# EAGLE design nasmini (EAGLE 6.5.0)
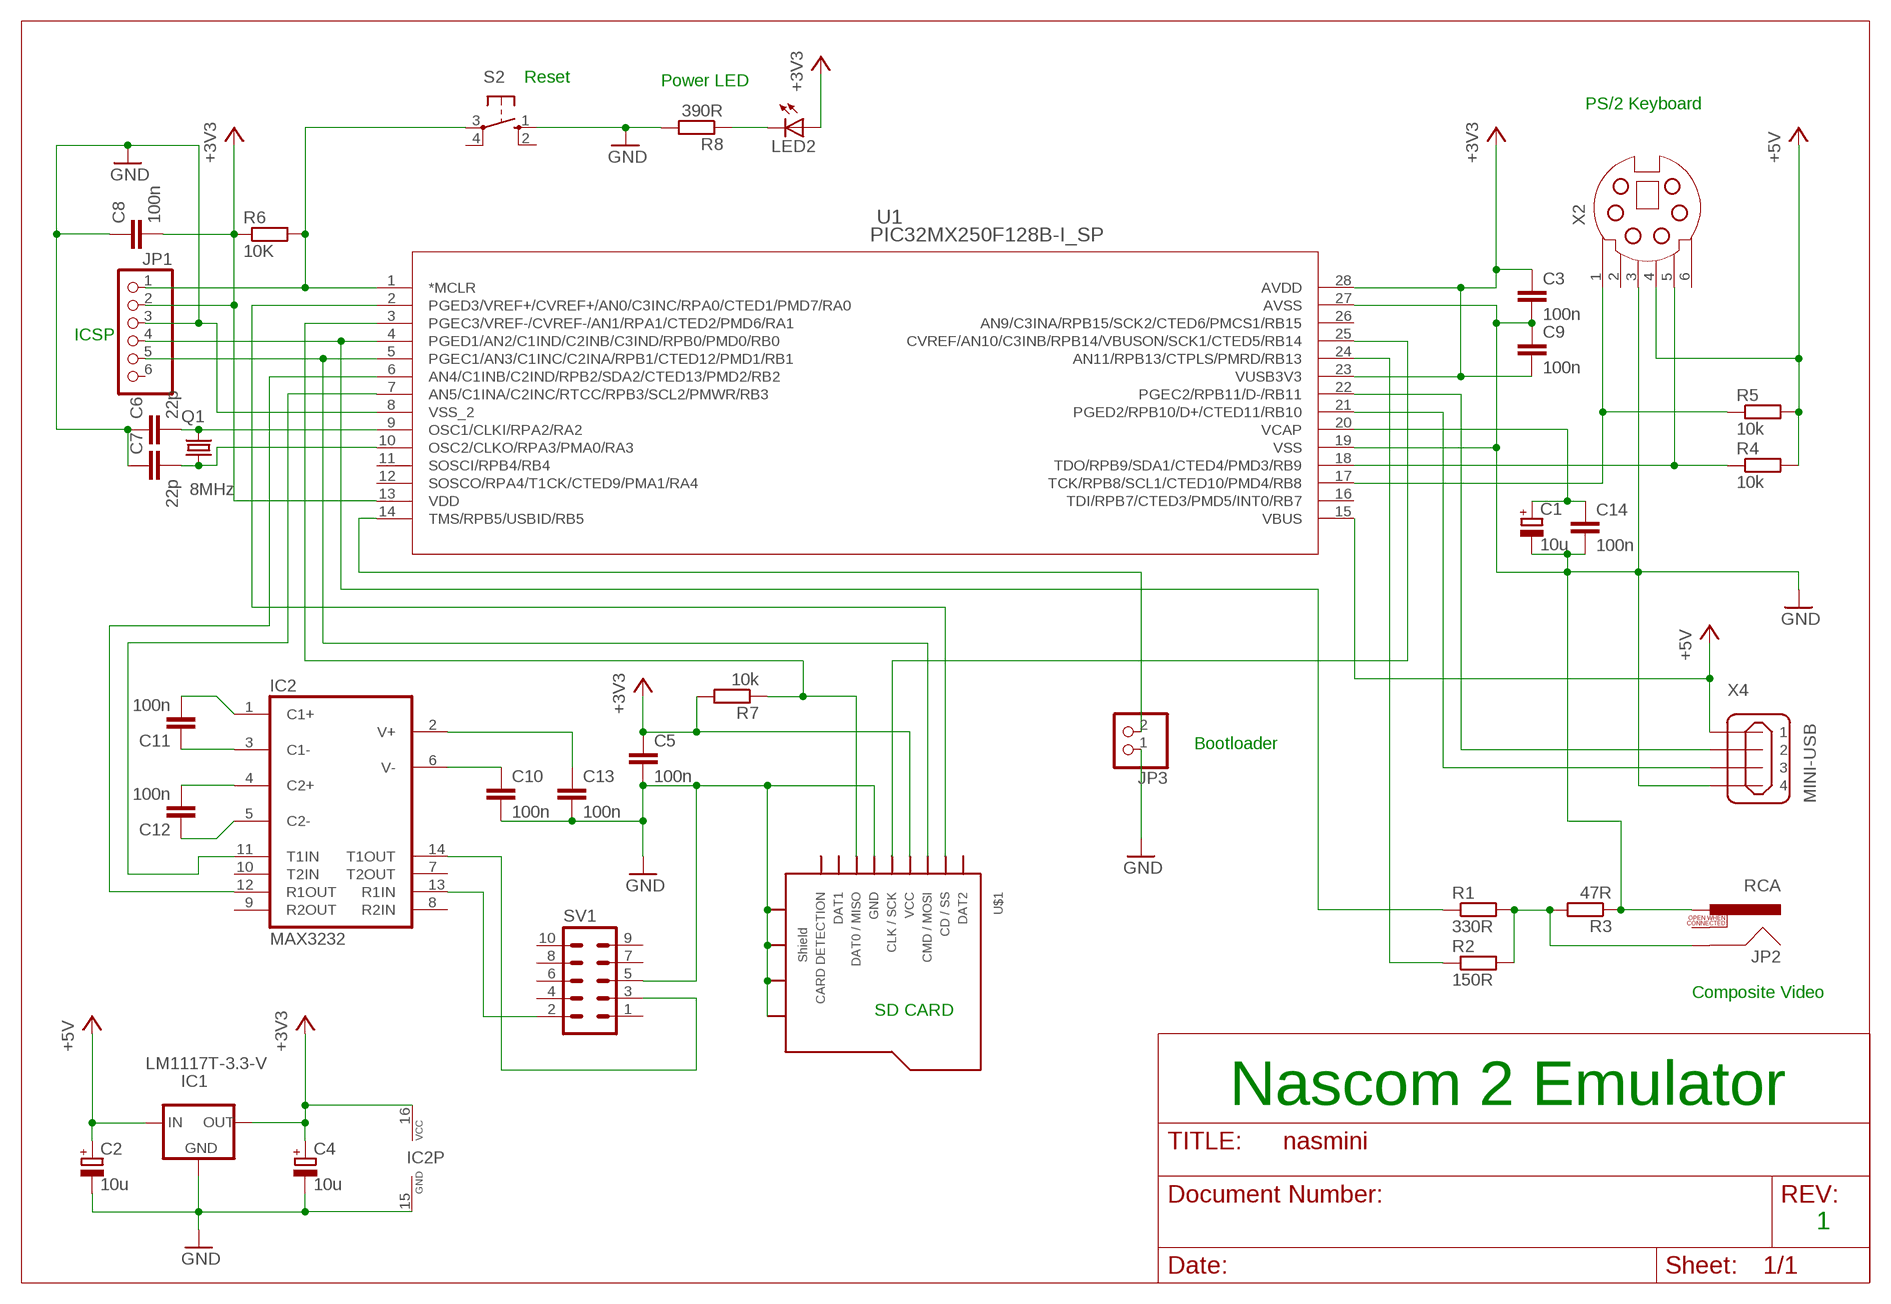
[diagram p0: schematic, sheet 1]

## Parts
C1  10u  CPOL-EUE2.5-5  [E2,5-5]
C2  10u  CPOL-EUE2.5-5  [E2,5-5]
C3  100n  C-EU025-025X050  [C025-025X050]
C4  10u  CPOL-EUE2.5-5  [E2,5-5]
C5  100n  C-EU025-025X050  [C025-025X050]
C6  22p  C-EU025-025X050  [C025-025X050]
C7  22p  C-EU025-025X050  [C025-025X050]
C8  100n  C-EU025-025X050  [C025-025X050]
C9  100n  C-EU025-025X050  [C025-025X050]
C10  100n  C-EU025-025X050  [C025-025X050]
C11  100n  C-EU025-025X050  [C025-025X050]
C12  100n  C-EU025-025X050  [C025-025X050]
C13  100n  C-EU025-025X050  [C025-025X050]
C14  100n  C-EU025-025X050  [C025-025X050]
IC1  LM1117T-3.3-V  [TO220V]
IC2  MAX3232  MAX232  [DIL16]
JP1  PINHD-1X6  [1X06]
JP2  RCA  [RCA]
JP3  PINHD-1X2  [1X02]
LED2  LED3MM  [LED3MM]
Q1  8MHz  CRYSTALHC49S  [HC49/S]
R1  330R  R-EU_0207/7  [0207/7]
R2  150R  R-EU_0207/7  [0207/7]
R3  47R  R-EU_0207/7  [0207/7]
R4  10k  R-EU_0207/7  [0207/7]
R5  10k  R-EU_0207/7  [0207/7]
R6  10K  R-EU_0207/7  [0207/7]
R7  10k  R-EU_0207/7  [0207/7]
R8  390R  R-EU_0207/7  [0207/7]
S2  10-XX  [B3F-10XX]
SV1  MA05-2  [MA05-2]
U1  PIC32MX250F128B-I_SP  [SPDIP28_300MC]
U$1  MICROSD_CARD_POLLIN  [MR**-AP*03**]
X2  MDSSV-F06  [SSV-BC06]
X4  MINI-USB  MINI-USB_SHIELD4P-85-32006-201-1  [85-32006-201-1]

## Nets
+3V3: C3.1 C4.+ C5.1 C8.2 C9.2 IC1.2(OUT) IC2.16(VCC) JP1.2 LED2.A R6.1 R7.2 U1.13(VDD) U1.23(VUSB3V3) U1.28(AVDD) U$1.VCC
+5V: C2.+ IC1.3(IN) R4.2 R5.2 U1.15(VBUS) X2.4 X4.1
GND: C1.- C2.- C3.2 C4.- C5.2 C6.1 C7.1 C8.1 C9.1 C10.2 C13.2 C14.2 IC1.1(GND) IC2.15(GND) JP1.3 JP2.PIN JP3.1 R3.1 R8.2 S2.1(S) SV1.5 U1.8(VSS_2) U1.19(VSS) U1.27(AVSS) U$1.GND U$1.SHD_1(SHD1) U$1.SHD_2(SHD2) U$1.SHD_3(SHD3) U$1.SHD_4(SHD4) X2.3 X4.4
N$1: R5.1 U1.17(TCK/RPB8/SCL1/CTED10/PMD4/RB8) X2.1
N$2: R4.1 U1.18(TDO/RPB9/SDA1/CTED4/PMD3/RB9) X2.5
N$3: R2.1 U1.24(AN11/RPB13/CTPLS/PMRD/RB13)
N$4: JP3.2 U1.14(TMS/RPB5/USBID/RB5)
N$5: JP2.SHELL R1.2 R2.2 R3.2
N$6: IC2.13(R1IN) SV1.2
N$7: C1.+ C14.1 U1.20(VCAP)
N$8: JP1.4 R1.1 U1.4(PGED1/AN2/C1IND/C2INB/C3IND/RPB0/PMD0/RB0)
N$9: JP1.1 R6.2 S2.3(P) U1.1(*MCLR)
N$10: U1.25(CVREF/AN10/C3INB/RPB14/VBUSON/SCK1/CTED5/RB14) U$1.CLK(CLK/SCK)
N$11: U1.2(PGED3/VREF+/CVREF+/AN0/C3INC/RPA0/CTED1/PMD7/RA0) U$1.DAT3/CS(CD/SS)
N$12: R7.1 U1.3(PGEC3/VREF-/CVREF-/AN1/RPA1/CTED2/PMD6/RA1) U$1.DAT0(DAT0/MISO)
N$13: JP1.5 U1.5(PGEC1/AN3/C1INC/C2INA/RPB1/CTED12/PMD1/RB1) U$1.CMD(CMD/MOSI)
N$14: U1.21(PGED2/RPB10/D+/CTED11/RB10) X4.3
N$15: C7.2 Q1.1 U1.10(OSC2/CLKO/RPA3/PMA0/RA3)
N$16: C6.2 Q1.2 U1.9(OSC1/CLKI/RPA2/RA2)
N$17: U1.22(PGEC2/RPB11/D-/RB11) X4.2
N$20: C13.1 IC2.2(V+)
N$21: C10.1 IC2.6(V-)
N$22: C12.1 IC2.5(C2-)
N$23: C12.2 IC2.4(C2+)
N$24: C11.1 IC2.3(C1-)
N$25: C11.2 IC2.1(C1+)
N$26: IC2.11(T1IN) U1.7(AN5/C1INA/C2INC/RTCC/RPB3/SCL2/PMWR/RB3)
N$27: IC2.12(R1OUT) U1.6(AN4/C1INB/C2IND/RPB2/SDA2/CTED13/PMD2/RB2)
N$28: LED2.K(C) R8.1
N$29: IC2.14(T1OUT) SV1.3
Unconnected: IC2.7(T2OUT) IC2.8(R2IN) IC2.9(R2OUT) IC2.10(T2IN) JP1.6 JP2.SWITCH S2.2(S1) S2.4(P1) SV1.1 SV1.4 SV1.6 SV1.7 SV1.8 SV1.9 SV1.10 U1.11(SOSCI/RPB4/RB4) U1.12(SOSCO/RPA4/T1CK/CTED9/PMA1/RA4) U1.16(TDI/RPB7/CTED3/PMD5/INT0/RB7) U1.26(AN9/C3INA/RPB15/SCK2/CTED6/PMCS1/RB15) U$1.CARD_DETECTION(CARD_D) U$1.DAT1 U$1.DAT2 X2.2 X2.6 X4.M1(S1) X4.M2(S2)

## Notes on the sheet
- Reset | Power LED
- PS/2 Keyboard
- ICSP
- Bootloader
- Composite Video
- SD CARD
- Nascom 2 Emulator
- 1

## Library data of the parts
C1 C2 C4 = rcl:CPOL-EU: POLARIZED CAPACITOR, European symbol
C3 C5-C14 = rcl:C-EU: CAPACITOR, European symbol
IC1 = lm1117:LM1117T-*
IC2 = maxim:MAX232: RS232 TRANSCEIVER; MF: MAXIM; MPN: MAX232ACPE+; OC_FARNELL: 9723773; OC_NEWARK: 68K4544
JP1 = pinhead:PINHD-1X6: PIN HEADER
JP2 = SparkFun-Connectors:RCA
JP3 = pinhead:PINHD-1X2: PIN HEADER
LED2 = led:LED: LED OSRAM: - CHIPLED LG R971, LG N971, LY N971, LG Q971, LY Q971, LO R971, LY R971 LH N974, LH R974 LS Q976, LO Q976, LY Q976 LO Q996 - Hyper CHIPLED LW Q18S LB Q993, LB Q99A, LB R99A - SideLED LS A670, LO A670, LY A670, LG A670, LP A670 LB A673, LV A673, LT A673, LW A673 LH A674 LY A675 LS A676, LA A676, LO A676, LY A676, LW A676 LS A679, LY A679, LG A679 - Hyper Micro SIDELED® LS Y876, LA Y876, LO Y876, LY Y876 LT Y87S - SmartLED LW L88C, LW L88S LB L89C, LB L89S, LG L890 LS L89K, LO L89K, LY L89K LS L896, LA L896, LO L896, LY L896 - TOPLED LS T670, LO T670, LY T670, LG T670, LP T670 LSG T670, LSP T670, LSY T670, LOP T670, LYG T670 LG T671, LOG T671, LSG T671 LB T673, LV T673, LT T673, LW T673 LH T674 LS T676, LA T676, LO T676, LY T676, LB T676, LH T676, LSB T676, LW T676 LB T67C, LV T67C, LT T67C, LS T67K, LO T67K, LY T67K, LW E67C LS E67B, LA E67B, LO E67B, LY E67B, LB E67C, LV E67C, LT E67C LW T67C LS T679, LY T679, LG T679 LS T770, LO T770, LY T770, LG T770, LP T770 LB T773, LV T773, LT T773, LW T773 LH T774 LS E675, LA E675, LY E675, LS T675 LS T776, LA T776, LO T776, LY T776, LB T776 LHGB T686 LT T68C, LB T68C - Hyper Mini TOPLED® LB M676 - Mini TOPLED Santana® LG M470 LS M47K, LO M47K, LY M47K Source: http://www.osram.convergy.de LUXEON: - LUMILED® LXK2-PW12-R00, LXK2-PW12-S00, LXK2-PW14-U00, LXK2-PW14-V00 LXK2-PM12-R00, LXK2-PM12-S00, LXK2-PM14-U00 LXK2-PE12-Q00, LXK2-PE12-R00, LXK2-PE12-S00, LXK2-PE14-T00, LXK2-PE14-U00 LXK2-PB12-K00, LXK2-PB12-L00, LXK2-PB12-M00, LXK2-PB14-N00, LXK2-PB14-P00, LXK2-PB14-Q00 LXK2-PR12-L00, LXK2-PR12-M00, LXK2-PR14-Q00, LXK2-PR14-R00 LXK2-PD12-Q00, LXK2-PD12-R00, LXK2-PD12-S00 LXK2-PH12-R00, LXK2-PH12-S00 LXK2-PL12-P00, LXK2-PL12-Q00, LXK2-PL12-R00 Source: www.luxeon.com KINGBRIGHT: KA-3528ASYC Source: www.kingbright.com
Q1 = crystal:CRYSTAL: CRYSTAL; OC_FARNELL: 1667008; OC_NEWARK: unknown
R1-R8 = rcl:R-EU_: RESISTOR, European symbol
S2 = switch-omron:10-XX: OMRON SWITCH; MPN: B3F-1000; OC_FARNELL: 176432; OC_NEWARK: 36M3542
SV1 = con-lstb:MA05-2: PIN HEADER; OC_FARNELL: unknown; OC_NEWARK: unknown
U1 = pic32mx12:PIC32MX250F128B-I_SP
U$1 = 000_eigene_Bauteile:MICROSD_CARD_POLLIN
X2 = con-yamaichi:MDSSV-F06: YAMAICHI CONNECTOR; OC_FARNELL: unknown; OC_NEWARK: unknown
X4 = con-cypressindustries:MINI-USB_SHIELD4P-: MINI USB 4 Pol. Source: www.cypressindustries.com; OC_FARNELL: unknown; OC_NEWARK: unknown

## Board
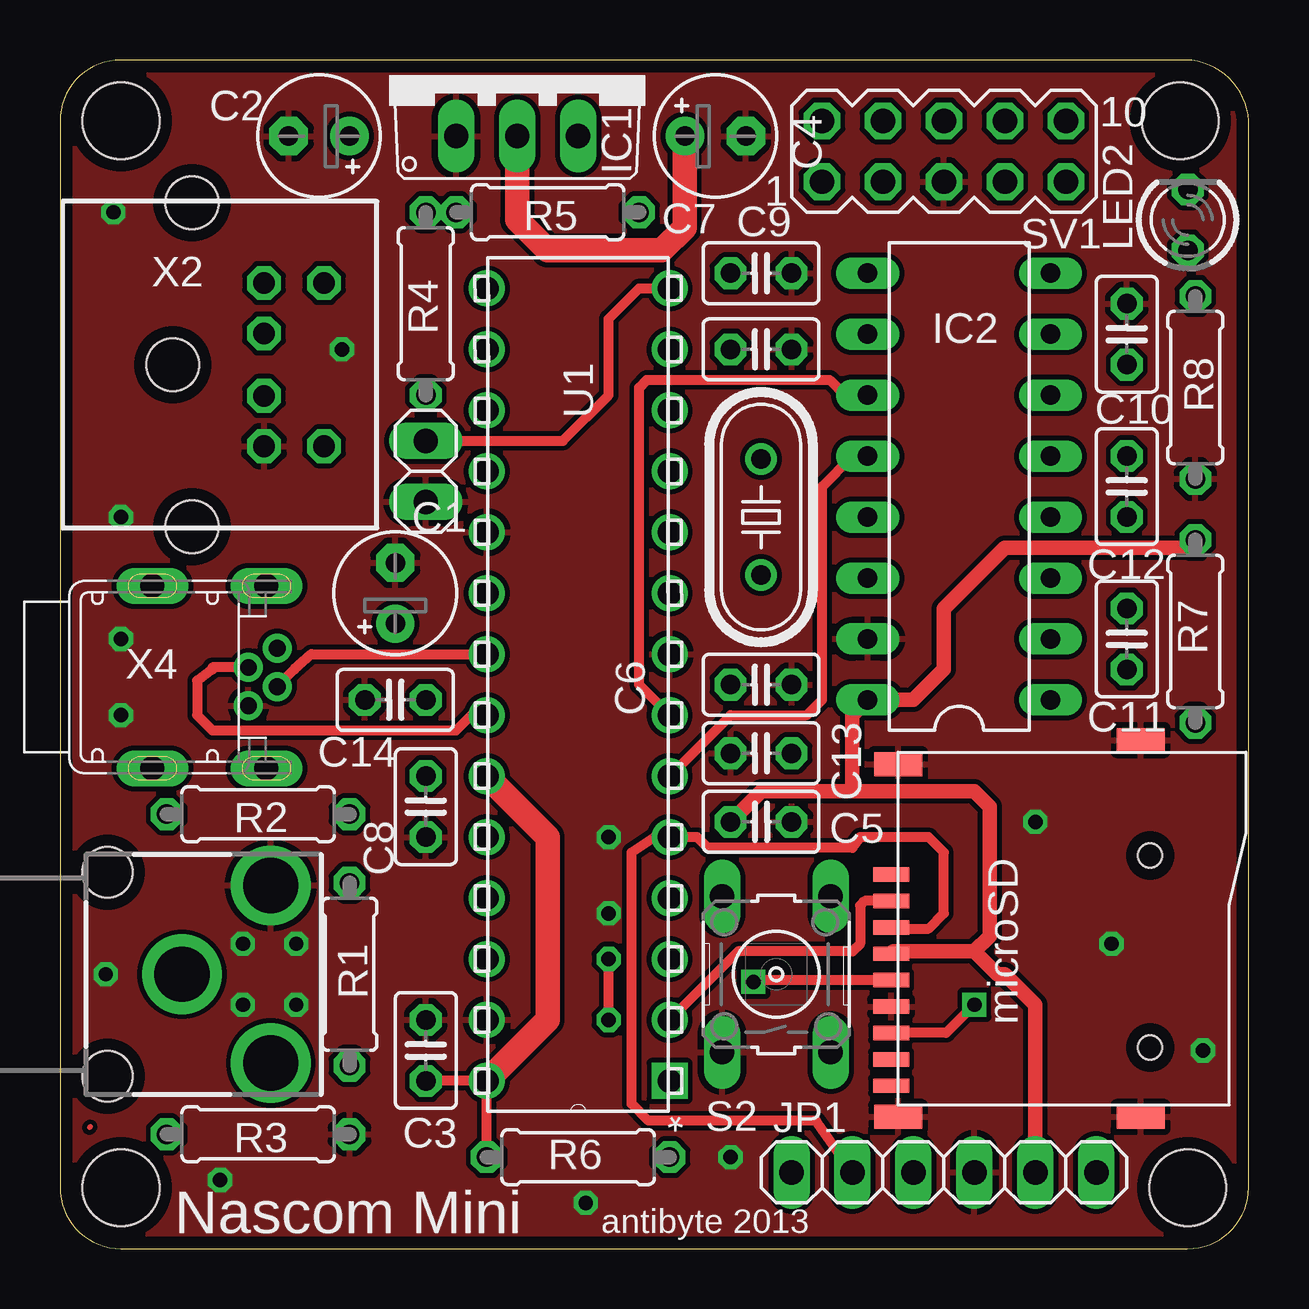
[diagram p1: board, top side]
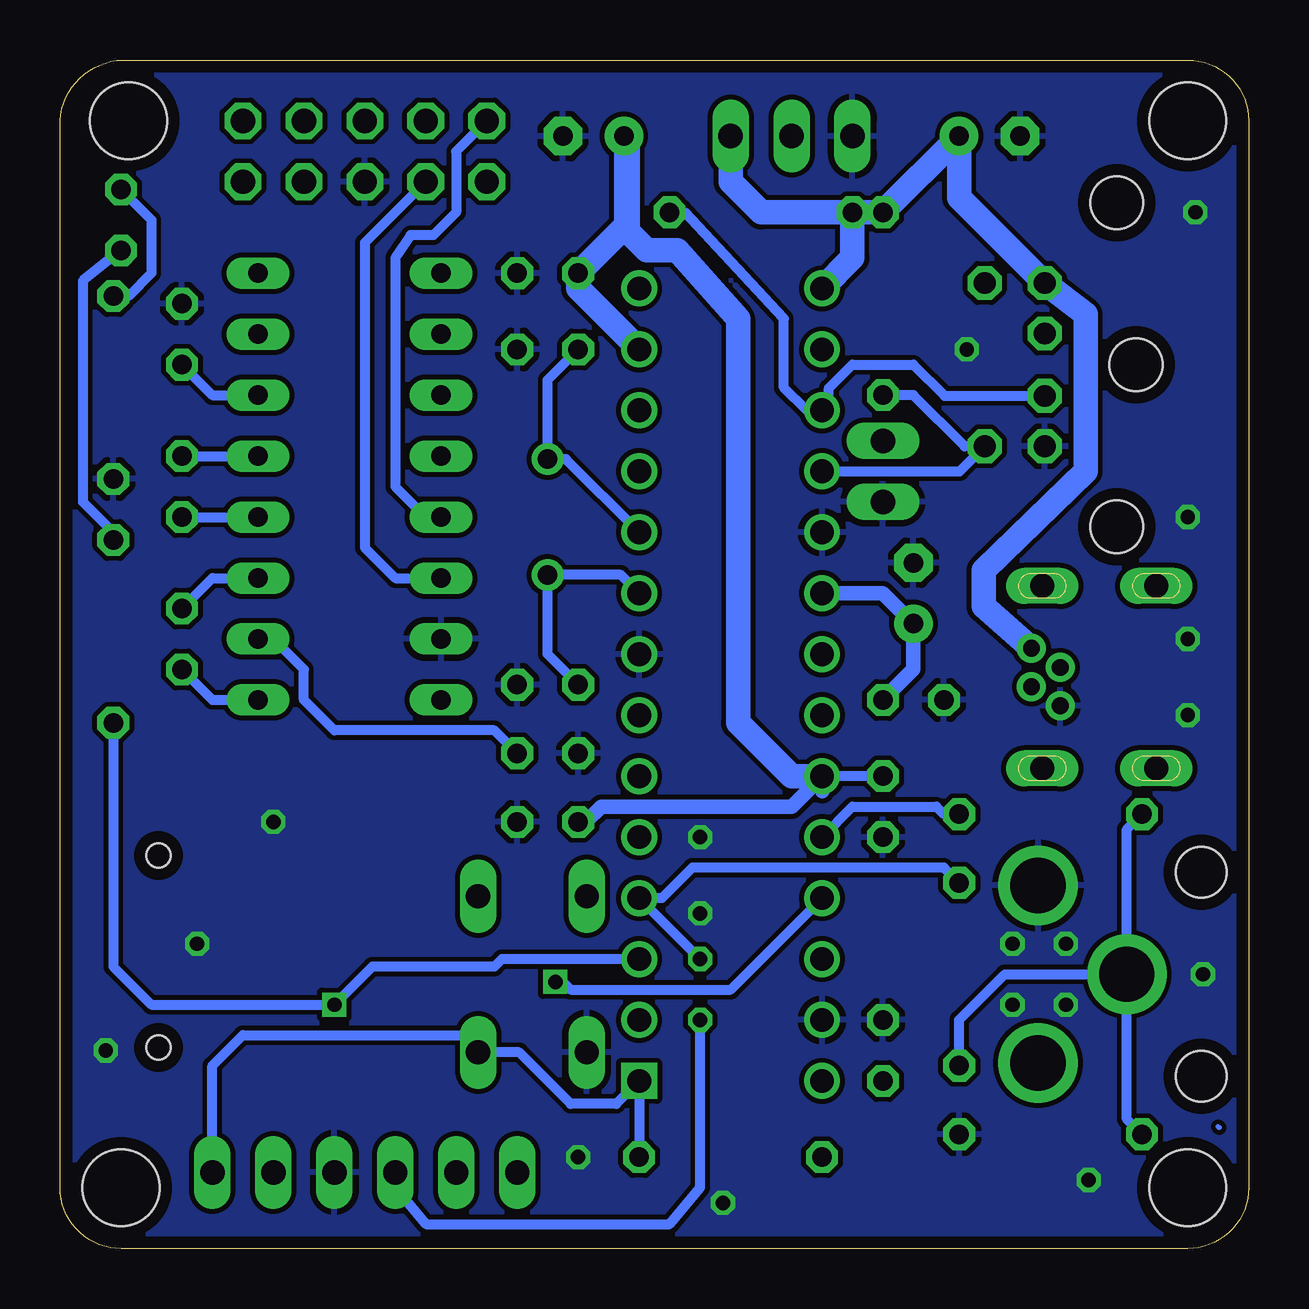
[diagram p2: board, bottom side, seen from below]

Size 49.53 x 49.52 mm. Coordinates in mm from the lower left corner, seen from the top.
Outline: 2.54,0 46.98,0 arc90 49.53,2.54 49.53,46.99 arc90 46.66,49.52 2.54,49.52 arc90 0,46.99 0,2.54 arc90 2.54,0
Copper layers (1*16): Top 0.035mm / dielectric 1.5mm / Bottom 0.035mm
Design rules "default *": minimum track width 8mil, minimum drill 24mil, track to track 8mil, track to pad 8mil, pad to pad 8mil, via to via 8mil, smd to smd 8mil, copper to edge 20mil, drill to drill 8mil, minimum pad ring 10mil, minimum via ring 8mil, stop-mask expansion 4mil, vias tented up to drill 0mil, thermal gap 10mil
Holes 3.2 mm at 2.54,2.54 2.54,46.99 46.99,2.54 46.67,46.99

### Footprints (pad centres in the part's own frame; a part is rotated, then mirrored left to right if it is on the bottom)
E2,5-5 = drill 0.813 pad 1.6: + -1.27,0 | drill 0.813 pad 1.6 octagon: - 1.27,0
C025-025X050 = drill 0.813 octagon: 1 -1.27,0; 2 1.27,0
TO220V = drill 1.016 long: 1 -2.54,-2.54; 2 0,-2.54; 3 2.54,-2.54
DIL16 = drill 0.813 long: 1 -8.89,-3.81; 2 -6.35,-3.81; 3 -3.81,-3.81; 4 -1.27,-3.81; 5 1.27,-3.81; 6 3.81,-3.81; 7 6.35,-3.81; 8 8.89,-3.81; 9 8.89,3.81; 10 6.35,3.81; 11 3.81,3.81; 12 1.27,3.81; 13 -1.27,3.81; 14 -3.81,3.81; 15 -6.35,3.81; 16 -8.89,3.81
1X06 = drill 1.016 long: 1 -6.35,0; 2 -3.81,0; 3 -1.27,0; 4 1.27,0; 5 3.81,0; 6 6.35,0
RCA = drill 2.3: PIN 3.7,3.7; SHELL 0,0; SWITCH 3.7,-3.7 | hole 2.1: -3.1,4.25; -3.1,-4.25
1X02 = drill 1.016 long: 1 -1.27,0; 2 1.27,0
LED3MM = drill 0.813 octagon: A -1.27,0; K 1.27,0
HC49/S = drill 0.813: 1 -2.413,0; 2 2.413,0
0207/7 = drill 0.813 octagon: 1 -3.81,0; 2 3.81,0
B3F-10XX = drill 1.016 long: 1 -3.251,2.261; 2 3.251,2.261; 3 -3.251,-2.261; 4 3.251,-2.261
MA05-2 = drill 1.016 octagon: 1 -5.08,-1.27; 2 -5.08,1.27; 3 -2.54,-1.27; 4 -2.54,1.27; 5 0,-1.27; 6 0,1.27; 7 2.54,-1.27; 8 2.54,1.27; 9 5.08,-1.27; 10 5.08,1.27
SPDIP28_300MC = drill 0.991 square: 1 -7.62,33.02 | drill 0.991: 2 -7.62,30.48; 3 -7.62,27.94; 4 -7.62,25.4; 5 -7.62,22.86; 6 -7.62,20.32; 7 -7.62,17.78; 8 -7.62,15.24; 9 -7.62,12.7; 10 -7.62,10.16; 11 -7.62,7.62; 12 -7.62,5.08; 13 -7.62,2.54; 14 -7.62,0; 15 0,0; 16 0,2.54; 17 0,5.08; 18 0,7.62; 19 0,10.16; 20 0,12.7; 21 0,15.24; 22 0,17.78; 23 0,20.32; 24 0,22.86; 25 0,25.4; 26 0,27.94; 27 0,30.48; 28 0,33.02
MR**-AP*03** = smd 0.6 x 1.5: CARD_DETECTION -6.55,0.3; CLK -2.15,0.3; CMD 0.05,0.3; DAT0 -4.35,0.3; DAT1 -5.45,0.3; DAT2 2.25,0.3; DAT3/CS 1.15,0.3; GND -3.25,0.3; VCC -1.05,0.3 | smd 1 x 2: SHD_1 -7.85,0; SHD_2 6.85,0; SHD_3 -7.85,-10.1; SHD_4 7.85,-10.1 | hole 1: -4.95,-10.5; 3.05,-10.5
SSV-BC06 = drill 0.9 octagon: 1 1.3,8.5; 2 -1.3,8.5; 3 3.4,8.5; 4 -3.4,8.5; 5 3.4,11; 6 -3.4,11 | hole 2.2: -6.75,5.5; 0,4.7; 6.75,5.5
85-32006-201-1 = drill 0.7 pad 1.1: 1 -1.2,8.1; 2 -0.4,6.9; 3 0.4,8.1; 4 1.2,6.9 | drill 1 pad 1.4 long: M1 -3.8,2.9; M2 3.8,2.9; M3 -3.8,7.65; M4 3.8,7.65

### Placement (x,y rotation side)
C1  13.97,27.3 90 top
C2  10.79,46.35 180 top
C3  15.24,8.26 90 top
C4  27.3,46.35 0 top
C5  29.21,17.78 0 top
C6  29.21,23.5 180 top
C7  29.21,37.47 180 top
C8  15.24,18.41 90 top
C9  29.21,40.64 180 top
C10  44.45,38.1 90 top
C11  44.45,25.4 270 top
C12  44.45,31.75 270 top
C13  29.21,20.64 180 top
C14  13.97,22.86 180 top
IC1  19.05,48.9 0 top
IC2  37.47,31.75 90 top
JP1  36.83,3.17 180 top
JP2  5.08,11.43 0 top
JP3  15.24,32.38 90 top
LED2  46.99,42.86 90 top
Q1  29.21,30.48 270 top
R1  12.06,11.43 270 top
R2  8.26,18.1 180 top
R3  8.26,4.76 180 top
R4  15.24,39.37 90 top
R5  20.32,43.18 180 top
R6  21.59,3.81 0 top
R7  47.31,25.72 90 top
R8  47.31,35.88 270 top
S2  29.84,11.43 90 top
SV1  36.83,45.72 0 top
U1  17.78,40.01 180 top
U$1  34.92,13.34 90 top
X2  0,36.83 270 top
X4  0.95,23.81 270 top

### Tracks (layer width: path | path; a pad name or v marks a point on that pad's centre or on a via)
+3V3
  Top 0.406: R6.1 U1.28 C3.1 | U$1.VCC 34.72,12.38
  Top 0.61: C5.1 29.21,19.05 33.02,19.05 | 33.02,19.05 38.1,19.05 38.73,18.41 38.73,13.02 38.1,12.38 | 33.02,19.05 33.02,22.23 IC2.16 35.56,22.86 36.83,24.13 36.83,26.67 39.37,29.21 46.99,29.21 R7.2 | 34.72,12.38 38.1,12.38 | 38.1,12.38 39.05,11.43 39.37,11.43 40.64,10.16 JP1.2
  Top 1.016: IC1.2 19.05,42.86 20.32,41.59 25.08,41.59 26.04,42.55 C4.+ | U1.28 20.32,9.53 20.32,17.14 U1.23
  Bottom 0.254: 47.31,29.84 R7.2 | 27.62,17.78 C5.1
  Bottom 0.406: LED2.A 48.58,40.32 48.58,31.11 47.31,29.84 | C8.2 U1.23
  Bottom 0.61: 27.62,17.78 26.99,18.41 19.05,18.41 U1.23 17.78,19.05
  Bottom 0.813: 26.04,42.55 C4.+ 25.88,46.2
  Bottom 1.016: 26.04,42.55 C9.2 27.94,40.01 U1.13 | U1.23 19.05,19.68 21.27,21.91 21.27,38.73 23.81,41.59 25.08,41.59 25.88,42.39 25.88,46.2
+5V
  Bottom 0.813: 8.48,40.23 X2.4
  Bottom 1.016: X4.1 11.05,26.75 11.05,28.26 6.79,32.38 6.79,38.92 8.48,40.23 | U1.15 16.51,41.27 R5.2 | R5.2 R4.2 C2.+ 12.06,43.8 X2.4 | R5.2 20.32,43.18 21.59,44.45 IC1.3
GND  (via drill 0.6)
  other vias: 22.86,13.97 40.64,17.78 27.94,3.81 22.86,17.14 1.91,11.43 7.62,12.7 7.62,10.16 9.84,10.16 9.84,12.7 47.62,8.26 43.81,12.7 11.75,37.47 6.67,2.86 2.22,43.18 2.54,25.4 2.54,22.23 2.54,30.48 21.91,1.91
  pour Bottom: 0,49.53 49.53,49.53 49.53,0 0,0
  pour Top: 0,49.53 49.53,49.53 49.53,0 0,0
N$1
  Bottom 0.406: R5.1 23.5,43.18 19.37,38.73 19.37,35.88 18.41,34.92 U1.17 17.49,35.21 17.49,35.85 16.51,36.83 13.97,36.83 12.67,35.53 X2.1
N$2
  Bottom 0.406: R4.1 13.97,35.56 11.84,33.43 X2.5 12.04,32.38 U1.18
N$3
  Bottom 0.406: U1.24 16.51,18.41 13.02,18.41 12.7,18.1 R2.1
N$4
  Top 0.406: JP3.2 20.95,33.66 22.86,35.56 22.86,38.73 24.13,40.01 U1.14
N$5
  Bottom 0.406: R1.2 12.06,9.53 10.16,11.43 JP2.SHELL | JP2.SHELL 5.08,17.46 R2.2 | R3.2 5.08,5.4 JP2.SHELL
N$6
  Bottom 0.406: SV1.2 33.02,45.72 33.02,43.18 33.97,42.23 34.92,42.23 35.56,41.27 35.56,31.75 34.29,30.48 IC2.13
N$7
  Bottom 0.61: C14.1 13.97,24.13 C1.+ 15.24,27.3 U1.20
N$8  (via drill 0.6)
  Top 0.406: v22.86,9.53 v22.86,12.06
  Bottom 0.254: JP1.4 35.56,2.54
  Bottom 0.406: R1.1 12.7,15.88 23.18,15.88 24.45,14.61 U1.4 v22.86,12.06 | 35.56,2.54 34.29,1.02 24.13,1.02 22.86,2.54 v22.86,9.53
N$9
  Bottom 0.406: JP1.1 43.18,7.62 41.91,8.89 32.82,8.89 S2.3 30.4,8.18 28.26,6.03 26.35,6.03 U1.1 R6.2
N$10  (via drill 0.6)
  Top 0.406: U$1.CLK 28.96,11.19 v28.89,11.11
  Bottom 0.406: v28.89,11.11 28.57,11.11 28.26,10.79 21.59,10.79 U1.25
N$11
  Top 0.406: U$1.DAT3/CS 33.53,14.48 33.34,14.29 33.34,12.7 33.02,12.38 28.26,12.38 U1.2
N$12  (via drill 0.6)
  Top 0.406: v38.1,10.16 36.92,8.98 U$1.DAT0
  Bottom 0.406: R7.1 47.31,11.75 45.72,10.16 v38.1,10.16 36.51,11.75 31.43,11.75 31.11,12.06 U1.3
N$13
  Top 0.254: U$1.CMD 34.67,13.34
  Top 0.406: 34.67,13.34 36.2,13.34 36.83,13.97 36.83,16.51 36.2,17.14 33.34,17.14 33.02,16.7 26.99,16.7 26.54,17.14 U1.5 24.77,17.14 23.81,16.51 23.81,6.03 24.51,5.33 31.5,5.33 JP1.5
N$14
  Top 0.406: X4.3 9.77,24.13 10.48,24.77 U1.21
N$15
  Bottom 0.406: U1.10 28.45,32.89 Q1.1 29.21,36.2 C7.2
N$16
  Bottom 0.406: U1.9 26.16,28.07 Q1.2 29.21,24.77 C6.2
N$17
  Top 0.406: X4.2 6.35,24.21 6.35,24.13 5.71,23.66 5.71,22.23 6.35,21.59 16.51,21.59 17.14,22.23 U1.22
N$18
  Top 0.203: 1.27,5.08 1.22,5.04
N$19
  Bottom 0.203: 1.27,5.08 1.22,5.04
N$20
  Bottom 0.406: C13.1 31.43,21.59 38.1,21.59 39.37,22.86 39.37,24.13 40.64,25.4 IC2.2
N$21
  Bottom 0.406: C10.1 43.18,35.56 IC2.6
N$22
  Bottom 0.406: C12.1 IC2.5
N$23
  Bottom 0.406: C12.2 IC2.4
N$24
  Bottom 0.406: C11.1 43.18,27.94 IC2.3
N$25
  Bottom 0.406: C11.2 43.18,22.86 IC2.1
N$26
  Top 0.406: U1.7 24.13,23.5 24.13,35.88 24.45,36.2 32.07,36.2 32.7,35.56 IC2.11
N$27
  Top 0.406: U1.6 27.94,22.23 31.11,22.23 31.75,22.86 31.75,31.75 33.02,33.02 IC2.12
N$28
  Bottom 0.406: LED2.K 45.72,42.86 45.72,40.64 46.67,39.69 R8.1
N$29
  Bottom 0.406: SV1.3 36.83,41.91 36.83,29.21 35.56,27.94 IC2.14

### Text on the board
tPlace: Nascom Mini | antibyte 2013